# Altium project pdb_pcb.PrjPcb
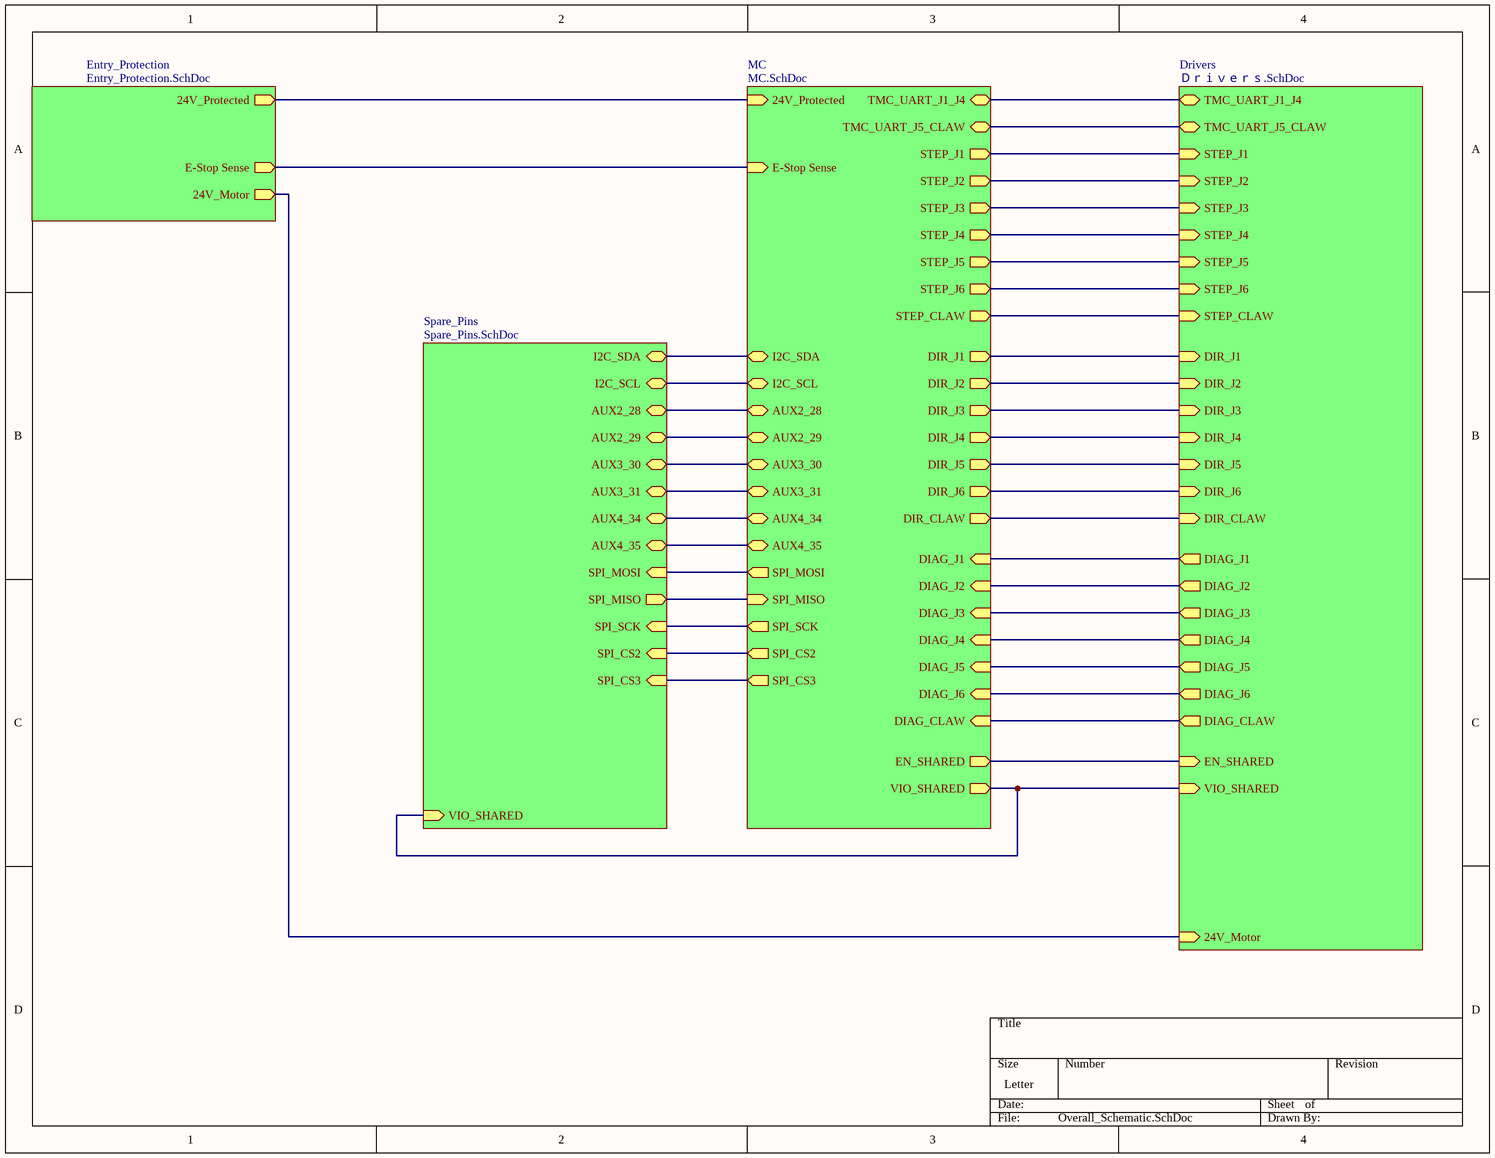
[diagram p0: Overall_Schematic.SchDoc]
5 sheets, 120 parts. Net scope: hierarchical (ports join the sheet entries above them; power ports are global).
Board file: Carrier.PcbDoc
Sheets:
  Overall_Schematic.SchDoc
    Entry_Protection = Entry_Protection.SchDoc
    MC = MC.SchDoc
    Drivers = Ｄｒｉｖｅｒｓ.SchDoc
    Spare_Pins = Spare_Pins.SchDoc

## Sheet Overall_Schematic.SchDoc
size Letter; SheetNumber: 1; SheetTotal: 5

### Sub-sheets
Drivers = Ｄｒｉｖｅｒｓ.SchDoc: TMC_UART_J1_J4 (bidir), TMC_UART_J5_CLAW (bidir), STEP_CLAW (in), STEP_J6 (in), STEP_J5 (in), STEP_J4 (in), STEP_J3 (in), STEP_J2 (in), STEP_J1 (in), DIR_J1 (in), DIR_J2 (in), DIR_J3 (in), DIR_J4 (in), DIR_J5 (in), DIR_J6 (in), DIR_CLAW (in), DIAG_CLAW (out), DIAG_J6 (out), DIAG_J5 (out), DIAG_J4 (out), DIAG_J3 (out), DIAG_J2 (out), DIAG_J1 (out), EN_SHARED (in), VIO_SHARED (in), 24V_Motor (in)
Entry_Protection = Entry_Protection.SchDoc: 24V_Protected (out), 24V_Motor (out), E-Stop Sense (out)
MC = MC.SchDoc: 24V_Protected (in), TMC_UART_J1_J4 (bidir), TMC_UART_J5_CLAW (bidir), STEP_J1 (out), STEP_J2 (out), STEP_J3 (out), STEP_J4 (out), STEP_J5 (out), STEP_J6 (out), STEP_CLAW (out), DIR_J1 (out), DIR_J2 (out), DIR_J3 (out), DIR_J4 (out), DIR_J5 (out), DIR_J6 (out), DIR_CLAW (out), DIAG_J1 (in), DIAG_J2 (in), DIAG_J3 (in), DIAG_J4 (in), DIAG_J5 (in), DIAG_J6 (in), DIAG_CLAW (in), EN_SHARED (out), VIO_SHARED (out), E-Stop Sense (in), I2C_SDA (bidir), I2C_SCL (bidir), AUX2_28 (bidir), AUX2_29 (bidir), AUX3_30 (bidir), AUX3_31 (bidir), AUX4_34 (bidir), AUX4_35 (bidir), SPI_MOSI (out), SPI_MISO (in), SPI_SCK (out), SPI_CS2 (out), SPI_CS3 (out)
Spare_Pins = Spare_Pins.SchDoc: VIO_SHARED (in), I2C_SDA (bidir), I2C_SCL (bidir), AUX2_28 (bidir), AUX2_29 (bidir), AUX3_30 (bidir), AUX3_31 (bidir), AUX4_34 (bidir), AUX4_35 (bidir), SPI_MOSI (in), SPI_MISO (out), SPI_SCK (in), SPI_CS2 (in), SPI_CS3 (in)

### Nets
24V_Motor: sheet Entry_Protection/24V_Motor, sheet Drivers/24V_Motor
24V_Protected: sheet Entry_Protection/24V_Protected, sheet MC/24V_Protected
EN_SHARED: sheet MC/EN_SHARED, sheet Drivers/EN_SHARED
VIO_SHARED: sheet MC/VIO_SHARED, sheet Drivers/VIO_SHARED, sheet Spare_Pins/VIO_SHARED
NetC31_1: sheet MC/I2C_SDA, sheet Spare_Pins/I2C_SDA
NetC32_1: sheet MC/I2C_SCL, sheet Spare_Pins/I2C_SCL
NetC33_1: sheet MC/AUX2_28, sheet Spare_Pins/AUX2_28
NetC34_1: sheet MC/AUX2_29, sheet Spare_Pins/AUX2_29
NetC35_1: sheet MC/AUX3_30, sheet Spare_Pins/AUX3_30
NetC36_1: sheet MC/AUX3_31, sheet Spare_Pins/AUX3_31
NetC37_1: sheet MC/AUX4_34, sheet Spare_Pins/AUX4_34
NetC38_1: sheet MC/AUX4_35, sheet Spare_Pins/AUX4_35
NetJ3_4: sheet Entry_Protection/E-Stop Sense, sheet MC/E-Stop Sense
NetR6_1: sheet MC/STEP_CLAW, sheet Drivers/STEP_CLAW
NetR7_2: sheet MC/STEP_J3, sheet Drivers/STEP_J3
NetR8_2: sheet MC/STEP_J2, sheet Drivers/STEP_J2
NetR12_1: sheet MC/STEP_J6, sheet Drivers/STEP_J6
NetR13_1: sheet MC/STEP_J5, sheet Drivers/STEP_J5
NetR14_2: sheet MC/TMC_UART_J5_CLAW, sheet Drivers/TMC_UART_J5_CLAW
NetR15_1: sheet MC/STEP_J1, sheet Drivers/STEP_J1
NetR16_2: sheet MC/TMC_UART_J1_J4, sheet Drivers/TMC_UART_J1_J4
NetR18_2: sheet MC/STEP_J4, sheet Drivers/STEP_J4
NetR30_1: sheet MC/SPI_MOSI, sheet Spare_Pins/SPI_MOSI
NetR31_1: sheet MC/SPI_MISO, sheet Spare_Pins/SPI_MISO
NetR32_1: sheet MC/SPI_SCK, sheet Spare_Pins/SPI_SCK
NetR33_1: sheet MC/SPI_CS2, sheet Spare_Pins/SPI_CS2
NetR34_1: sheet MC/SPI_CS3, sheet Spare_Pins/SPI_CS3
NetU2_14: sheet MC/DIR_J1, sheet Drivers/DIR_J1
NetU2_15: sheet MC/DIR_J2, sheet Drivers/DIR_J2
NetU2_16: sheet MC/DIR_J3, sheet Drivers/DIR_J3
NetU2_17: sheet MC/DIR_J4, sheet Drivers/DIR_J4
NetU2_20: sheet MC/DIR_J5, sheet Drivers/DIR_J5
NetU2_21: sheet MC/DIR_J6, sheet Drivers/DIR_J6
NetU2_22: sheet MC/DIR_CLAW, sheet Drivers/DIR_CLAW
NetU2_24: sheet MC/DIAG_J1, sheet Drivers/DIAG_J1
NetU2_25: sheet MC/DIAG_J2, sheet Drivers/DIAG_J2
NetU2_26: sheet MC/DIAG_J3, sheet Drivers/DIAG_J3
NetU2_27: sheet MC/DIAG_J4, sheet Drivers/DIAG_J4
NetU2_38: sheet MC/DIAG_J5, sheet Drivers/DIAG_J5
NetU2_39: sheet MC/DIAG_J6, sheet Drivers/DIAG_J6
NetU2_40: sheet MC/DIAG_CLAW, sheet Drivers/DIAG_CLAW

## Sheet Entry_Protection.SchDoc
size Letter; SheetNumber: 2; SheetTotal: 5
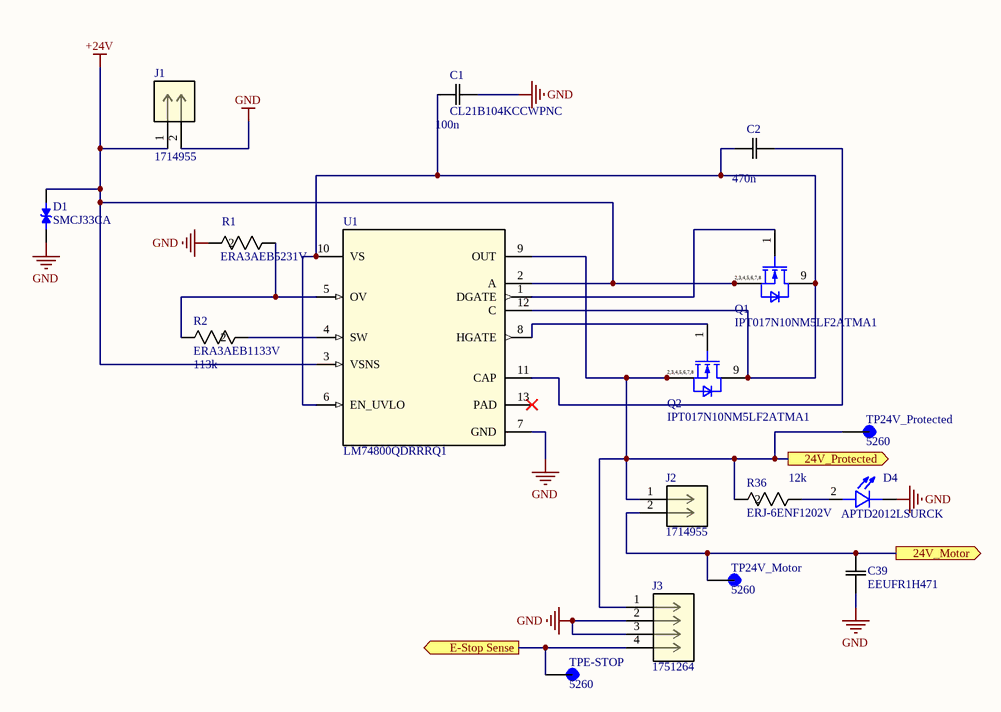
[diagram p1: Entry_Protection.SchDoc]

### Parts
C1  CL21B104KCCWPNC  Capacitor: 100n  [CAP_CL_21_SAM]
C2  Capacitance: 470n  [CAP_2012_TDK]
C39  EEUFR1H471  [CAP_12.5 X 20_PAN]
D1  SMCJ33CA  [DIOM6859X262N]
D4  APTD2012LSURCK  [LED_APTD2012LSURCK]
J1  1714955  [CONN_1714955_PXC]
J2  1714955  [CONN_1714955_PXC]
J3  1751264  [CONN_1751264_PXC]
Q1  IPT017N10NM5LF2ATMA1  [IFX-PG-HSOF-8-1-1-V]
Q2  IPT017N10NM5LF2ATMA1  [IFX-PG-HSOF-8-1-1-V]
R1  ERA3AEB5231V  [RES_ERA3A_0603_PAN]
R2  ERA3AEB1133V  Resistance: 113k  [RES_ERA3A_0603_PAN]
R36  ERJ-6ENF1202V  Resistance: 12k  [RC0805N_PAN]
TP24V_Motor  5260  [KEYSTONE_5260]
TP24V_Protected  5260  [KEYSTONE_5260]
TPE-STOP  5260  [KEYSTONE_5260]
U1  LM74800QDRRRQ1  [DRR0012E]

### Ports
24V_Motor (out, see Overall_Schematic[1A], Ｄｒｉｖｅｒｓ[1A]), 24V_Protected (out, see Overall_Schematic[1A], MC[1A]), E-Stop Sense (out, see Overall_Schematic[1A], MC[2B])

### Nets
+24V: D1.2 J1.1 Q1.2(SOURCE) Q1.3(SOURCE) Q1.4(SOURCE) Q1.5(SOURCE) Q1.6(SOURCE) Q1.7(SOURCE) Q1.8(SOURCE) U1.2(A) U1.3(VSNS)
GND: C1.2 C39.2 D1.1 D4.1(C) J1.2 J3.2 J3.3 R1.2 U1.7(GND)
24V_Motor: C39.1 J2.2 TP24V_Motor.1(TP) ; port 24V_Motor
24V_Protected: J2.1 J3.1 Q2.2(SOURCE) Q2.3(SOURCE) Q2.4(SOURCE) Q2.5(SOURCE) Q2.6(SOURCE) Q2.7(SOURCE) Q2.8(SOURCE) R36.2 TP24V_Protected.1(TP) U1.9(OUT) ; port 24V_Protected
NetC1_1: C1.1 C2.1 Q1.9(DRAIN) Q2.9(DRAIN) U1.6(EN_UVLO) U1.10(VS) U1.12(C)
NetC2_2: C2.2 U1.11(CAP)
NetD4_2: D4.2(A) R36.1
NetJ3_4: J3.4 TPE-STOP.1(TP) ; port E-Stop Sense
NetQ1_1: Q1.1(GATE) U1.1(DGATE)
NetQ2_1: Q2.1(GATE) U1.8(HGATE)
NetR1_1: R1.1 R2.1 U1.5(OV)
NetR2_2: R2.2 U1.4(SW)

Not connected (* = marked no-connect by the designer): U1 13(PAD)*

### Notes on the sheet
- (in symbol IPT017N10NM5LF2) 2,3,4,5,6,7,8

### Library data of the parts
C1 = CL21B104KCCWPNC: No Description Available; Manufacturer_Name: Samsung; Copyright: Copyright (C) 2026 Ultra Librarian. All rights reserved.; Manufacturer_Part_Number: CL21B104KCCWPNC
C2 = C2012X7R1H474K125AB: No Description Available; Manufacturer_Name: TDK; Copyright: Copyright (C) 2026 Ultra Librarian. All rights reserved.; Manufacturer_Part_Number: C2012X7R1H474K125AB
C39 = EEUFR1H471: Description; Manufacturer_Name: Panasonic; Copyright: Copyright (C) 2025 Ultra Librarian. All rights reserved.; Manufacturer_Part_Number: EEUFR1H471
D1 = CMP-004-00031-1: Availability: Unavailable; Case/Package: None; Price: None; Source: SMCJ33CA.SchLib; Value: *; Pins: 2; Component Type: Standard; Design Item ID: SMCJ33CA; MP: SMCJ33CA
D4 = CMP-005-000000-1: Red 630nm LED Indication - Discrete 1.75V 0805 (2012 Metric); MF: Kingbright; Design Item ID: APTD2012LSURCK; SnapEDA_Link: https://www.snapeda.com/parts/APTD2012LSURCK/Kingbright/view-part/?ref=snap; Component Type: Standard; Check_prices: https://www.snapeda.com/parts/APTD2012LSURCK/Kingbright/view-part/?ref=eda; Pin Count: 2; Package: 0805 Kingbright; MP: APTD2012LSURCK; Source: APTD2012LSURCK.SchLib; Value: *
J1 J2 = 1714955: PCB terminal block, nominal current: 32 A, rated voltage (III/2): 630 V, nominal cross section: 4 mmÂ², number of potentials: 2, number of rows: 1, number of positions per row: 2, product range: MKDS 5, pitch: 6.35 mm, connection method: Screw connection with tension sleeve, screw head form: L Slotted, mounting: Wave soldering, conductor/PCB connection direction: 0 Â°, color: green, Pin layout: Linear pinning, Solder pin [P]: 5.1 mm, number of solder pins per potential: 1, type of packaging: packed in cardboard. The article can be aligned to create different nos. of positions!; Manufacturer_Name: Phoenix Contact; Copyright: Copyright (C) 2025 Ultra Librarian. All rights reserved.; Manufacturer_Part_Number: 1714955; RefDes: RefDes; Type: Type
J3 = 1751264: PCB terminal block, nominal current: 17.5 A, rated voltage (III/2): 200 V, nominal cross section: 1.5 mmÂ², number of potentials: 4, number of rows: 1, number of positions per row: 4, product range: MKDS 1, pitch: 3.5 mm, connection method: Screw connection with tension sleeve, screw head form: L Slotted, mounting: Wave soldering, conductor/PCB connection direction: 0 Â°, color: green, Pin layout: Linear pinning, Solder pin [P]: 3.5 mm, number of solder pins per potential: 1, type of packaging: packed in cardboard. Suitable for CAT5; Manufacturer_Name: Phoenix Contact; Copyright: Copyright (C) 2025 Ultra Librarian. All rights reserved.; Manufacturer_Part_Number: 1751264; RefDes: RefDes; Type: Type
Q1 Q2 = IPT017N10NM5LF2: Insulated-Gate Field-Effect Transistor (IGFET), N-Channel, Enhancement, Body Diode, Pin 1 Gate, 2-8 Source, 9 Drain, 9 Pins; Manufacturer: Infineon Technologies; Manufacturer Order Number: IPT017N10NM5LF2; PackageReference: PG-HSOF-8-1
R1 = ERA3AEB5231V: Description; Manufacturer_Name: Panasonic; Copyright: Copyright (C) 2026 Ultra Librarian. All rights reserved.; Manufacturer_Part_Number: ERA3AEB5231V
R2 = ERA3AEB1133V: No Description Available; Manufacturer_Name: Panasonic; Copyright: Copyright (C) 2026 Ultra Librarian. All rights reserved.; Manufacturer_Part_Number: ERA3AEB1133V
R36 = ERJ-6ENF1202V: Description; Manufacturer_Name: Panasonic; Copyright: Copyright (C) 2026 Ultra Librarian. All rights reserved.; Manufacturer_Part_Number: ERJ-6ENF1202V
TP24V_Motor TP24V_Protected TPE-STOP = CMP-007-000000-1: TEST POINT (RED) - MINIATURE; MF: Keystone Electronics; MP: 5260; Source: 5260.SchLib; Check_prices: https://www.snapeda.com/parts/5260/Keystone/view-part/?ref=eda; SnapEDA_Link: https://www.snapeda.com/parts/5260/Keystone/view-part/?ref=snap; Package: None; Pin Count: 1; Value: *; Design Item ID: 5260; Component Type: Standard
U1 = LM74800QDRRRQ1: 3-V to 65-V, automotive ideal diode controller driving back to back NFETs 12-WSON -40 to 125; Manufacturer_Name: Texas Instruments; TYPE: TYPE; RefDes: RefDes; Copyright: Copyright (C) 2026 Ultra Librarian. All rights reserved.; Manufacturer_Part_Number: LM74800QDRRRQ1

## Sheet MC.SchDoc
size Letter; SheetNumber: 3; SheetTotal: 5
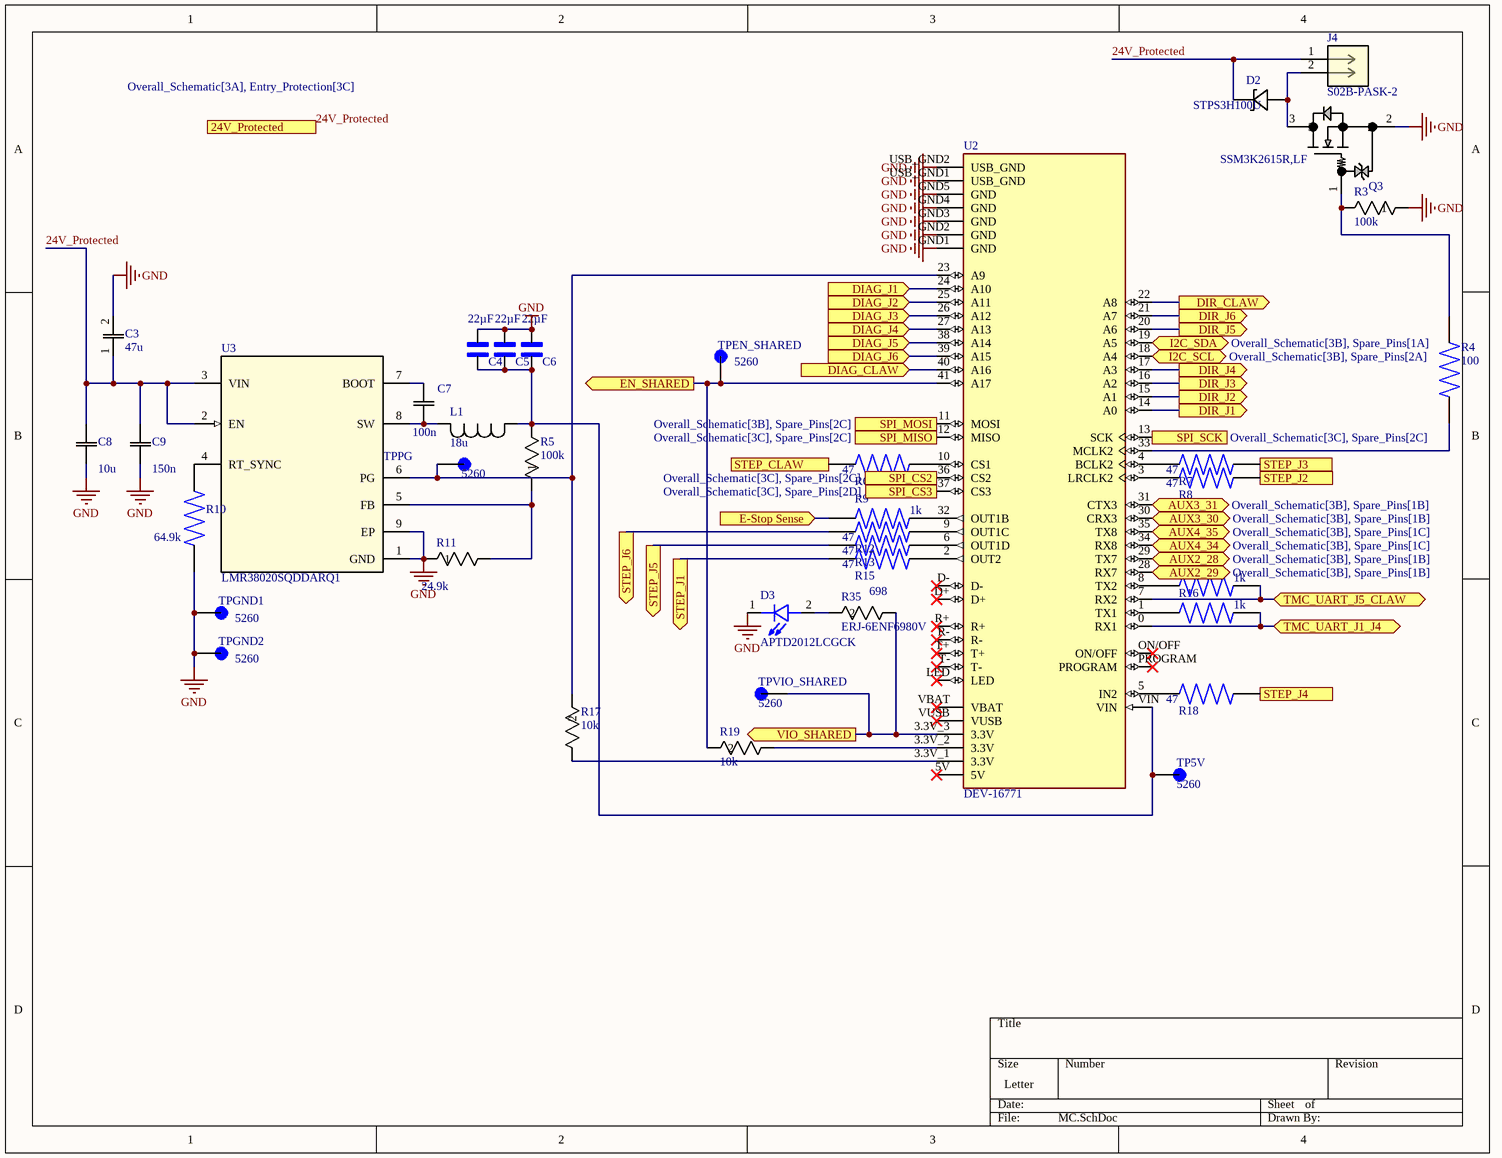
[diagram p2: MC.SchDoc]

### Parts
C3  Capacitance: 47u  [CAP_EEUFC_63X112_PAN]  (hidden comment: EEUFR1J470)
C4  Capacitance: 22µF  [CAPC3225X270N]  (hidden comment: CL32B226KAJNNNE)
C5  Capacitance: 22µF  [CAPC3225X270N]  (hidden comment: CL32B226KAJNNNE)
C6  Capacitance: 22µF  [CAPC3225X270N]  (hidden comment: CL32B226KAJNNNE)
C7  Capacitance: 100n  [CAP_CL_21_SAM]  (hidden comment: CL21B104KCCWPNC)
C8  Capacitance: 10u  [CAP_22201C106MAT2A_KYO]  (hidden comment: 22201C106MAT2A)
C9  Capacitance: 150n  [CAPC220145_140N_KEM]  (hidden comment: C0805C154K1RECTU)
D2  STPS3H100U  [SMB_STM]
D3  APTD2012LCGCK  [LED_APTD2012LCGCK]
J4  S02B-PASK-2  [CONN2_S02B-PASK-2_JST]
L1  Inductance: 18u  [IND_XGL6060_COC]  (hidden comment: XGL6060-183MEC)
Q3  SSM3K2615R,LF  [SOT-23F_TOS]
R3  Resistance: 100k  [RES_ERA3V,3K_PAN]  (hidden comment: ERA-3VEB1003V)
R4  value 100  [RES_ERA3VEB1000V]  (hidden comment: ERA3VEB1000V)
R5  Resistance: 100k  [RES_ERA3V,3K_PAN]  (hidden comment: ERA-3VEB1003V)
R6  Resistance: 47  [RES_ERA3VEB47R0V]  (hidden comment: ERA3VEB47R0V)
R7  Resistance: 47  [RES_ERA3VEB47R0V]  (hidden comment: ERA3VEB47R0V)
R8  Resistance: 47  [RES_ERA3VEB47R0V]  (hidden comment: ERA3VEB47R0V)
R9  value 1k  [RES_ERA3VEB1001V]  (hidden comment: ERA3VEB1001V)
R10  Resistance: 64.9k  [RES_ERJ3EKF6492V]  (hidden comment: ERJ3EKF6492V)
R11  Resistance: 24.9k  [RES_ERA3V,3K_PAN]  (hidden comment: ERA-3VEB2492V)
R12  Resistance: 47  [RES_ERA3VEB47R0V]  (hidden comment: ERA3VEB47R0V)
R13  Resistance: 47  [RES_ERA3VEB47R0V]  (hidden comment: ERA3VEB47R0V)
R14  value 1k  [RES_ERA3VEB1001V]  (hidden comment: ERA3VEB1001V)
R15  Resistance: 47  [RES_ERA3VEB47R0V]  (hidden comment: ERA3VEB47R0V)
R16  value 1k  [RES_ERA3VEB1001V]  (hidden comment: ERA3VEB1001V)
R17  Resistance: 10k  [RC0603N_PAN]  (hidden comment: ERJ-3EKF1002V)
R18  Resistance: 47  [RES_ERA3VEB47R0V]  (hidden comment: ERA3VEB47R0V)
R19  Resistance: 10k  [RC0603N_PAN]  (hidden comment: ERJ-3EKF1002V)
R35  ERJ-6ENF6980V  Resistance: 698  [RC0805N_PAN]
TP5V  5260  [KEYSTONE_5260]
TPEN_SHARED  5260  [KEYSTONE_5260]
TPGND1  5260  [KEYSTONE_5260]
TPGND2  5260  [KEYSTONE_5260]
TPPG  5260  [KEYSTONE_5260]
TPVIO_SHARED  5260  [KEYSTONE_5260]
U2  DEV-16771  [MODULE_DEV-16771]
U3  LMR38020SQDDARQ1  [DDA0008E-IPC_A]

### Ports
24V_Protected (in, see Overall_Schematic[3A], Entry_Protection[3C]), AUX2_28 (bidir, see Overall_Schematic[3B], Spare_Pins[1B]), AUX2_29 (bidir, see Overall_Schematic[3B], Spare_Pins[1B]), AUX3_30 (bidir, see Overall_Schematic[3B], Spare_Pins[1B]), AUX3_31 (bidir, see Overall_Schematic[3B], Spare_Pins[1B]), AUX4_34 (bidir, see Overall_Schematic[3B], Spare_Pins[1C]), AUX4_35 (bidir, see Overall_Schematic[3B], Spare_Pins[1C]), DIAG_CLAW (in, see Overall_Schematic[3C], Ｄｒｉｖｅｒｓ[4C]), DIAG_J1 (in, see Overall_Schematic[3B], Ｄｒｉｖｅｒｓ[1B]), DIAG_J2 (in, see Overall_Schematic[3C], Ｄｒｉｖｅｒｓ[2B]), DIAG_J3 (in, see Overall_Schematic[3C], Ｄｒｉｖｅｒｓ[3B]), DIAG_J4 (in, see Overall_Schematic[3C], Ｄｒｉｖｅｒｓ[4B]), DIAG_J5 (in, see Overall_Schematic[3C], Ｄｒｉｖｅｒｓ[1D]), DIAG_J6 (in, see Overall_Schematic[3C], Ｄｒｉｖｅｒｓ[2D]), DIR_CLAW (out, see Overall_Schematic[3B], Ｄｒｉｖｅｒｓ[3C]), DIR_J1 (out, see Overall_Schematic[3B], Ｄｒｉｖｅｒｓ[1B]), DIR_J2 (out, see Overall_Schematic[3B], Ｄｒｉｖｅｒｓ[2B]), DIR_J3 (out, see Overall_Schematic[3B], Ｄｒｉｖｅｒｓ[3B]), DIR_J4 (out, see Overall_Schematic[3B], Ｄｒｉｖｅｒｓ[4B]), DIR_J5 (out, see Overall_Schematic[3B], Ｄｒｉｖｅｒｓ[1D]), DIR_J6 (out, see Overall_Schematic[3B], Ｄｒｉｖｅｒｓ[2D]), E-Stop Sense (in, see Overall_Schematic[3A], Entry_Protection[2D]), EN_SHARED (out, see Overall_Schematic[3C], Ｄｒｉｖｅｒｓ[1A]), I2C_SCL (bidir, see Overall_Schematic[3B], Spare_Pins[2A]), I2C_SDA (bidir, see Overall_Schematic[3B], Spare_Pins[1A]), SPI_CS2 (out, see Overall_Schematic[3C], Spare_Pins[2C]), SPI_CS3 (out, see Overall_Schematic[3C], Spare_Pins[2D]), SPI_MISO (in, see Overall_Schematic[3C], Spare_Pins[2C]), SPI_MOSI (out, see Overall_Schematic[3B], Spare_Pins[2C]), SPI_SCK (out, see Overall_Schematic[3C], Spare_Pins[2C]), STEP_CLAW (out, see Overall_Schematic[3B], Ｄｒｉｖｅｒｓ[3C]), STEP_J1 (out, see Overall_Schematic[3A], Ｄｒｉｖｅｒｓ[1B]), STEP_J2 (out, see Overall_Schematic[3A], Ｄｒｉｖｅｒｓ[2B]), STEP_J3 (out, see Overall_Schematic[3A], Ｄｒｉｖｅｒｓ[2B]), STEP_J4 (out, see Overall_Schematic[3A], Ｄｒｉｖｅｒｓ[4B]), STEP_J5 (out, see Overall_Schematic[3A], Ｄｒｉｖｅｒｓ[1D]), STEP_J6 (out, see Overall_Schematic[3A], Ｄｒｉｖｅｒｓ[2D]), TMC_UART_J1_J4 (bidir, see Overall_Schematic[3A], Ｄｒｉｖｅｒｓ[1C]), TMC_UART_J5_CLAW (bidir, see Overall_Schematic[3A], Ｄｒｉｖｅｒｓ[1D]), VIO_SHARED (out, see Overall_Schematic[3C], Spare_Pins[1A], Ｄｒｉｖｅｒｓ[1A])

### Nets
GND: C3.2 C4.2 C5.2 C6.2 C8.1 C9.1 D3.1(C) Q3.2 R3.1 R10.1 R11.1 TPGND1.1(TP) TPGND2.1(TP) U2.GND1(GND) U2.GND2(GND) U2.GND3(GND) U2.GND4(GND) U2.GND5(GND) U2.USB_GND1(USB_GND) U2.USB_GND2(USB_GND) U3.1(GND) U3.9(EP)
24V_Protected: C3.1 C8.2 C9.2 D2.2(A) J4.1 U3.2(EN) U3.3(VIN) ; port 24V_Protected
EN_SHARED: R19.2 TPEN_SHARED.1(TP) U2.41(A17) ; port EN_SHARED
VIO_SHARED: R35.1 TPVIO_SHARED.1(TP) U2.3.3V_3(3.3V) ; port VIO_SHARED
NetC4_1: C4.1 C5.1 C6.1 L1.2 R5.2 TP5V.1(TP) U2.VIN
NetC7_1: C7.1 U3.7(BOOT)
NetC7_2: C7.2 L1.1 U3.8(SW)
NetC31_1: U2.19(A5) ; port I2C_SDA
NetC32_1: U2.18(A4) ; port I2C_SCL
NetC33_1: U2.29(TX7) ; port AUX2_28
NetC34_1: U2.28(RX7) ; port AUX2_29
NetC35_1: U2.30(CRX3) ; port AUX3_30
NetC36_1: U2.31(CTX3) ; port AUX3_31
NetC37_1: U2.34(RX8) ; port AUX4_34
NetC38_1: U2.35(TX8) ; port AUX4_35
NetD2_1: D2.1(K) J4.2 Q3.3
NetD3_2: D3.2(A) R35.2
NetJ3_4: R9.1 ; port E-Stop Sense
NetQ3_1: Q3.1 R3.2 R4.2
NetR4_1: R4.1 U2.33(MCLK2)
NetR5_1: R5.1 R11.2 U3.5(FB)
NetR6_1: R6.1 ; port STEP_CLAW
NetR6_2: R6.2 U2.10(CS1)
NetR7_1: R7.1 U2.4(BCLK2)
NetR7_2: R7.2 ; port STEP_J3
NetR8_1: R8.1 U2.3(LRCLK2)
NetR8_2: R8.2 ; port STEP_J2
NetR9_2: R9.2 U2.32(OUT1B)
NetR10_2: R10.2 U3.4(RT_SYNC)
NetR12_1: R12.1 ; port STEP_J6
NetR12_2: R12.2 U2.9(OUT1C)
NetR13_1: R13.1 ; port STEP_J5
NetR13_2: R13.2 U2.6(OUT1D)
NetR14_1: R14.1 U2.8(TX2)
NetR14_2: R14.2 U2.7(RX2) ; port TMC_UART_J5_CLAW
NetR15_1: R15.1 ; port STEP_J1
NetR15_2: R15.2 U2.2(OUT2)
NetR16_1: R16.1 U2.1(TX1)
NetR16_2: R16.2 U2.0(RX1) ; port TMC_UART_J1_J4
NetR17_1: R17.1 U2.3.3V_1(3.3V)
NetR17_2: R17.2 TPPG.1(TP) U2.23(A9) U3.6(PG)
NetR18_1: R18.1 U2.5(IN2)
NetR18_2: R18.2 ; port STEP_J4
NetR19_1: R19.1 U2.3.3V_2(3.3V)
NetR30_1: U2.11(MOSI) ; port SPI_MOSI
NetR31_1: U2.12(MISO) ; port SPI_MISO
NetR32_1: U2.13(SCK) ; port SPI_SCK
NetR33_1: U2.36(CS2) ; port SPI_CS2
NetR34_1: U2.37(CS3) ; port SPI_CS3
NetU2_14: U2.14(A0) ; port DIR_J1
NetU2_15: U2.15(A1) ; port DIR_J2
NetU2_16: U2.16(A2) ; port DIR_J3
NetU2_17: U2.17(A3) ; port DIR_J4
NetU2_20: U2.20(A6) ; port DIR_J5
NetU2_21: U2.21(A7) ; port DIR_J6
NetU2_22: U2.22(A8) ; port DIR_CLAW
NetU2_24: U2.24(A10) ; port DIAG_J1
NetU2_25: U2.25(A11) ; port DIAG_J2
NetU2_26: U2.26(A12) ; port DIAG_J3
NetU2_27: U2.27(A13) ; port DIAG_J4
NetU2_38: U2.38(A14) ; port DIAG_J5
NetU2_39: U2.39(A15) ; port DIAG_J6
NetU2_40: U2.40(A16) ; port DIAG_CLAW

Not connected (* = marked no-connect by the designer): U2 5V* D+* D-* LED* ON/OFF* PROGRAM* R+* R-* T+* T-* VBAT* VUSB*

### Library data of the parts
C3 = EEUFR1J470: Description; Manufacturer_Name: Panasonic; Copyright: Copyright (C) 2026 Ultra Librarian. All rights reserved.; Manufacturer_Part_Number: EEUFR1J470
C4-C6 = CMP-001-00083-1: 22 ÂµF Â±10% 25V Ceramic Capacitor X7R 1210 (3225 Metric); MF: Samsung Electro-Mechanics; Source: CL32B226KAJNNNE.SchLib; Component Type: Standard; Pins: 2; Case/Package: SMD-2 Samsung; Check_prices: https://www.snapeda.com/parts/CL32B226KAJNNNE/Samsung/view-part/?ref=eda; MP: CL32B226KAJNNNE; Design Item ID: CL32B226KAJNNNE; SnapEDA_Link: https://www.snapeda.com/parts/CL32B226KAJNNNE/Samsung/view-part/?ref=snap
C7 = CL21B104KCCWPNC: as C1 on sheet Entry_Protection; Copyright: Copyright (C) 2026 Ultra Librarian. All rights reserved.; Manufacturer_Part_Number: CL21B104KCCWPNC
C8 = 22201C106MAT2A: Description; Manufacturer_Name: KYOCERA AVX; Copyright: Copyright (C) 2026 Ultra Librarian. All rights reserved.; Manufacturer_Part_Number: 22201C106MAT2A
C9 = C0805C154K1RECTU: ESD SMD Comm X7R, Ceramic, 0.15 uF, 10%, 100 VDC, X7R, SMD, MLCC, Temperature Stable, Electro Static Discharge, Class II, 0805; Manufacturer_Name: Kemet; Copyright: Copyright (C) 2026 Ultra Librarian. All rights reserved.; Manufacturer_Part_Number: C0805C154K1RECTU
D2 = STPS3H100U: 100 V, 3 A Schottky rectifier; Manufacturer_Name: STMicroelectronics; Copyright: Copyright (C) 2025 Ultra Librarian. All rights reserved.; Manufacturer_Part_Number: STPS3H100U
D3 = CMP-003-000000-1: Green 570nm LED Indication - Discrete 1.9V 0805 (2012 Metric); MF: Kingbright; Value: *; MP: APTD2012LCGCK; Check_prices: https://www.snapeda.com/parts/APTD2012LCGCK/Kingbright/view-part/?ref=eda; Source: APTD2012LCGCK.SchLib; SnapEDA_Link: https://www.snapeda.com/parts/APTD2012LCGCK/Kingbright/view-part/?ref=snap; Component Type: Standard; Pin Count: 2; Design Item ID: APTD2012LCGCK; Package: 0805 Kingbright
J4 = S02B-PASK-2: Description; Manufacturer_Name: JST; Copyright: Copyright (C) 2026 Ultra Librarian. All rights reserved.; Manufacturer_Part_Number: S02B-PASK-2; RefDes: RefDes; Type: Type
L1 = XGL6060-183MEC: Description; Manufacturer_Name: Coilcraft; Copyright: Copyright (C) 2026 Ultra Librarian. All rights reserved.; Manufacturer_Part_Number: XGL6060-183MEC
Q3 = SSM3K2615R,LF: N-ch MOSFET, 60 V, 2.0 A, 0.3 Î©@10V, SOT-23F; Manufacturer_Name: Toshiba Electronic Devices & Storage Corp.; Copyright: Copyright (C) 2026 Ultra Librarian. All rights reserved.; Manufacturer_Part_Number: SSM3K2615R,LF; Datasheet: https://toshiba.semicon-storage.com/info/docget.jsp?did=15659&prodName=SSM3K2615R; RefDes: Refdes; Type: Type
R3 R5 = ERA-3VEB1003V: No Description Available; Manufacturer_Name: Panasonic; Copyright: Copyright (C) 2026 Ultra Librarian. All rights reserved.; Manufacturer_Part_Number: ERA-3VEB1003V
R4 = CMP-009-00180-1: Design Item ID: ERA3VEB1000V; MP: ERA3VEB1000V; Component Type: Standard; Pins: 2; Availability: Unavailable; Source: ERA3VEB1000V.SchLib; Case/Package: None; Price: None
R6-R8 R12 R13 R15 R18 = CMP-009-00179-1: MP: ERA3VEB47R0V; Component Type: Standard; Pins: 2; Source: ERA3VEB47R0V.SchLib; Price: None; Availability: Unavailable; Design Item ID: ERA3VEB47R0V; Case/Package: None
R9 R14 R16 = CMP-009-00178-1: Case/Package: None; Source: ERA3VEB1001V.SchLib; Price: None; Pins: 2; Availability: Unavailable; MP: ERA3VEB1001V; Design Item ID: ERA3VEB1001V; Component Type: Standard
R10 = CMP-009-00177-1: MF: {'manufacturer': u'Panasonic Electronic Components'}; Case/Package: None; Availability: Unavailable; Price: None; Component Type: Standard; MP: ERJ3EKF6492V; Source: ERJ3EKF6492V.SchLib; Design Item ID: ERJ3EKF6492V; Pins: 2
R11 = ERA-3VEB2492V: No Description Available; Manufacturer_Name: Panasonic; Copyright: Copyright (C) 2026 Ultra Librarian. All rights reserved.; Manufacturer_Part_Number: ERA-3VEB2492V
R17 R19 = ERJ-3EKF1002V: SMD-Resistor, 0603, 0,063W, 1%, 100ppm; Manufacturer_Name: Panasonic; Copyright: Copyright (C) 2025 Ultra Librarian. All rights reserved.; Manufacturer_Part_Number: ERJ-3EKF1002V
R35 = ERJ-6ENF6980V: No Description Available; Manufacturer_Name: Panasonic; Copyright: Copyright (C) 2026 Ultra Librarian. All rights reserved.; Manufacturer_Part_Number: ERJ-6ENF6980V
TP5V TPEN_SHARED TPGND1 TPGND2 TPPG TPVIO_SHARED = CMP-007-000000-1: as TP24V_Motor on sheet Entry_Protection; MP: 5260; Source: 5260.SchLib; Check_prices: https://www.snapeda.com/parts/5260/Keystone/view-part/?ref=eda; SnapEDA_Link: https://www.snapeda.com/parts/5260/Keystone/view-part/?ref=snap; Package: None; Pin Count: 1; Value: *; Design Item ID: 5260; Component Type: Standard
U2 = CMP-003-000000-1: RT1062 Teensy 4.1 series ARM® Cortex®-M7 MPU Embedded Evaluation Board; MF: SparkFun Electronics; Source: DEV-16771.SchLib; Design Item ID: DEV-16771; Pin Count: 65; Value: *; Check_prices: https://www.snapeda.com/parts/DEV-16771/SparkFun+Electronics/view-part/?ref=eda; Component Type: Standard; SnapEDA_Link: https://www.snapeda.com/parts/DEV-16771/SparkFun+Electronics/view-part/?ref=snap; Package: None; MP: DEV-16771
U3 = LMR38020SQDDARQ1: Automotive SIMPLE SWITCHERÂ® power converter 4.2-V to 80-V, 2-A, synchronous buck converter 8-SO PowerPAD -40 to 150; Manufacturer_Name: Texas Instruments; Copyright: Copyright (C) 2025 Ultra Librarian. All rights reserved.; Manufacturer_Part_Number: LMR38020SQDDARQ1; RefDes: >Name; TYPE: >Value

## Sheet Ｄｒｉｖｅｒｓ.SchDoc
size Letter; SheetNumber: 4; SheetTotal: 5
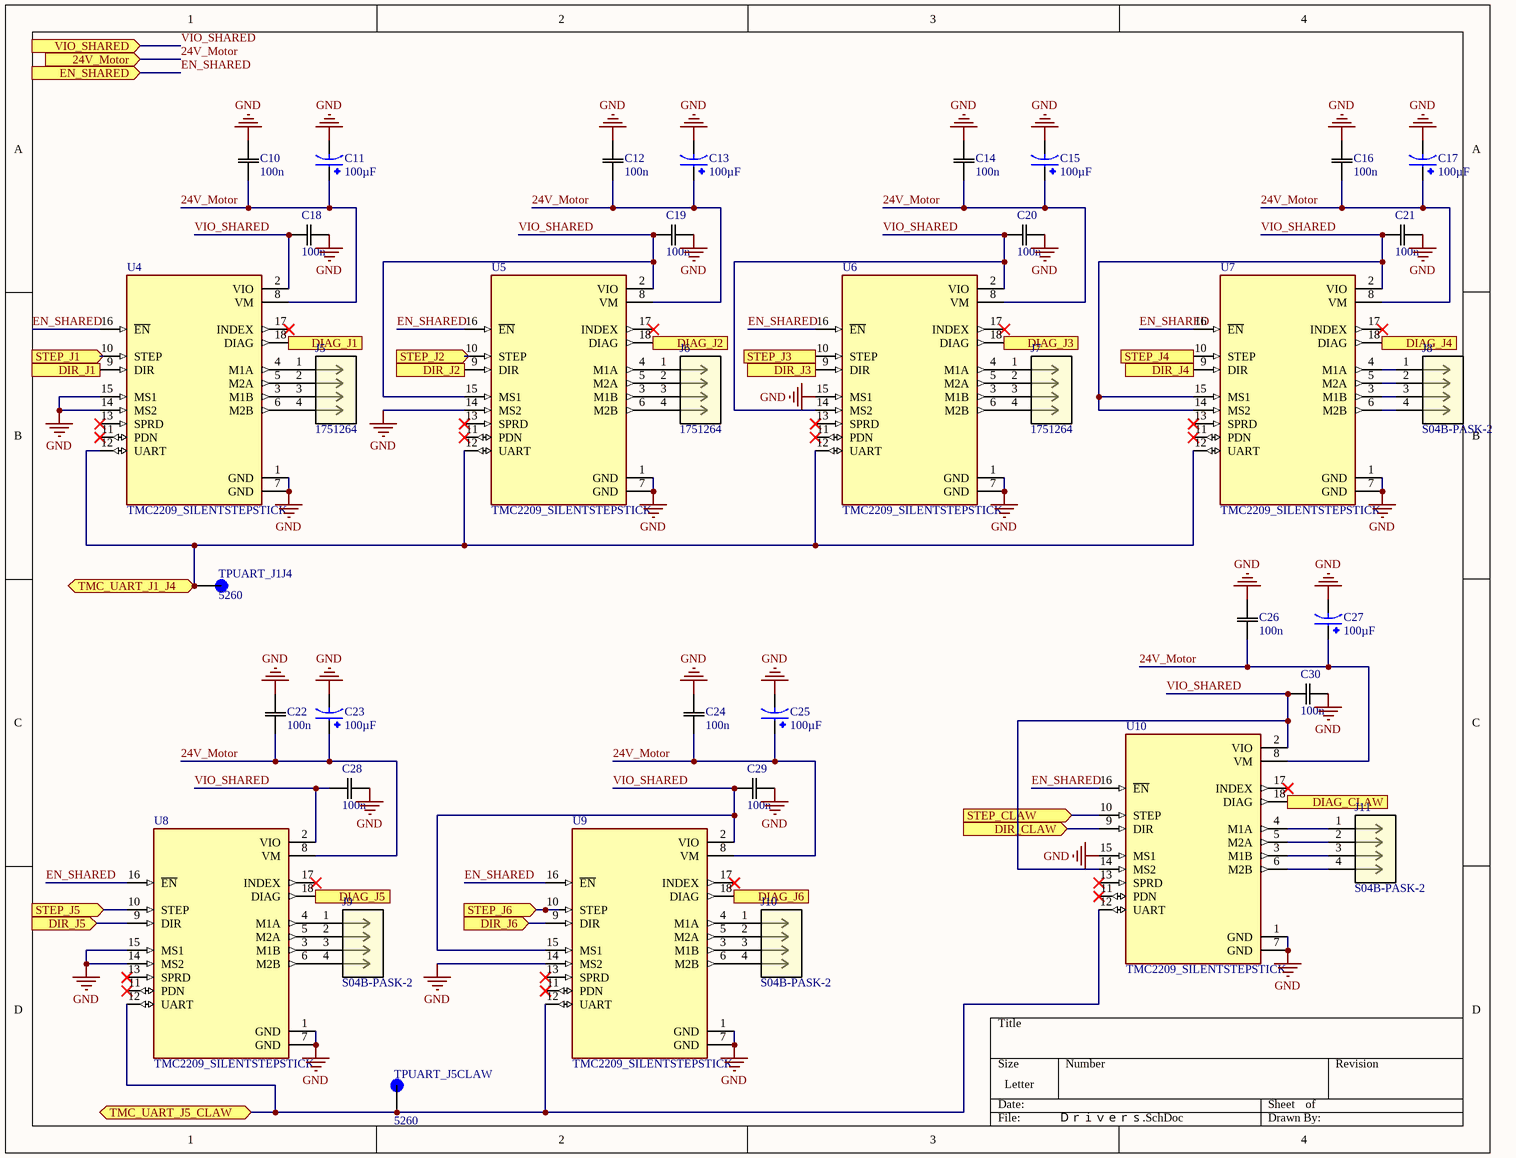
[diagram p3: Ｄｒｉｖｅｒｓ.SchDoc]

### Parts
C10  Capacitance: 100n  [CAP_CL_21_SAM]  (hidden comment: CL21B104KCCWPNC)
C11  value 100µF  [CAPPRD500W60D800H1150]  (hidden comment: EEUFR1H101B)
C12  Capacitance: 100n  [CAP_CL_21_SAM]  (hidden comment: CL21B104KCCWPNC)
C13  value 100µF  [CAPPRD500W60D800H1150]  (hidden comment: EEUFR1H101B)
C14  Capacitance: 100n  [CAP_CL_21_SAM]  (hidden comment: CL21B104KCCWPNC)
C15  value 100µF  [CAPPRD500W60D800H1150]  (hidden comment: EEUFR1H101B)
C16  Capacitance: 100n  [CAP_CL_21_SAM]  (hidden comment: CL21B104KCCWPNC)
C17  value 100µF  [CAPPRD500W60D800H1150]  (hidden comment: EEUFR1H101B)
C18  Capacitance: 100n  [CAP_CL_21_SAM]  (hidden comment: CL21B104KCCWPNC)
C19  Capacitance: 100n  [CAP_CL_21_SAM]  (hidden comment: CL21B104KCCWPNC)
C20  Capacitance: 100n  [CAP_CL_21_SAM]  (hidden comment: CL21B104KCCWPNC)
C21  Capacitance: 100n  [CAP_CL_21_SAM]  (hidden comment: CL21B104KCCWPNC)
C22  Capacitance: 100n  [CAP_CL_21_SAM]  (hidden comment: CL21B104KCCWPNC)
C23  value 100µF  [CAPPRD500W60D800H1150]  (hidden comment: EEUFR1H101B)
C24  Capacitance: 100n  [CAP_CL_21_SAM]  (hidden comment: CL21B104KCCWPNC)
C25  value 100µF  [CAPPRD500W60D800H1150]  (hidden comment: EEUFR1H101B)
C26  Capacitance: 100n  [CAP_CL_21_SAM]  (hidden comment: CL21B104KCCWPNC)
C27  value 100µF  [CAPPRD500W60D800H1150]  (hidden comment: EEUFR1H101B)
C28  Capacitance: 100n  [CAP_CL_21_SAM]  (hidden comment: CL21B104KCCWPNC)
C29  Capacitance: 100n  [CAP_CL_21_SAM]  (hidden comment: CL21B104KCCWPNC)
C30  Capacitance: 100n  [CAP_CL_21_SAM]  (hidden comment: CL21B104KCCWPNC)
J5  1751264  [CONN_1751264_PXC]
J6  1751264  [CONN_1751264_PXC]
J7  1751264  [CONN_1751264_PXC]
J8  S04B-PASK-2  [CONN4_S04B-PASK_JST]
J9  S04B-PASK-2  [CONN4_S04B-PASK_JST]
J10  S04B-PASK-2  [CONN4_S04B-PASK_JST]
J11  S04B-PASK-2  [CONN4_S04B-PASK_JST]
TPUART_J1J4  5260  [KEYSTONE_5260]
TPUART_J5CLAW  5260  [KEYSTONE_5260]
U4  TMC2209_SILENTSTEPSTICK  [MODULE_TMC2209_SILENTSTEPSTICK]
U5  TMC2209_SILENTSTEPSTICK  [MODULE_TMC2209_SILENTSTEPSTICK]
U6  TMC2209_SILENTSTEPSTICK  [MODULE_TMC2209_SILENTSTEPSTICK]
U7  TMC2209_SILENTSTEPSTICK  [MODULE_TMC2209_SILENTSTEPSTICK]
U8  TMC2209_SILENTSTEPSTICK  [MODULE_TMC2209_SILENTSTEPSTICK]
U9  TMC2209_SILENTSTEPSTICK  [MODULE_TMC2209_SILENTSTEPSTICK]
U10  TMC2209_SILENTSTEPSTICK  [MODULE_TMC2209_SILENTSTEPSTICK]

### Ports
24V_Motor (in, see Overall_Schematic[4D], Entry_Protection[4C]), DIAG_CLAW (out, see Overall_Schematic[4C], MC[3B]), DIAG_J1 (out, see Overall_Schematic[4B], MC[3A]), DIAG_J2 (out, see Overall_Schematic[4C], MC[3B]), DIAG_J3 (out, see Overall_Schematic[4C], MC[3B]), DIAG_J4 (out, see Overall_Schematic[4C], MC[3B]), DIAG_J5 (out, see Overall_Schematic[4C], MC[3B]), DIAG_J6 (out, see Overall_Schematic[4C], MC[3B]), DIR_CLAW (in, see Overall_Schematic[4B], MC[4B]), DIR_J1 (in, see Overall_Schematic[4B], MC[4B]), DIR_J2 (in, see Overall_Schematic[4B], MC[4B]), DIR_J3 (in, see Overall_Schematic[4B], MC[4B]), DIR_J4 (in, see Overall_Schematic[4B], MC[4B]), DIR_J5 (in, see Overall_Schematic[4B], MC[4B]), DIR_J6 (in, see Overall_Schematic[4B], MC[4B]), EN_SHARED (in, see Overall_Schematic[4C], MC[2B]), STEP_CLAW (in, see Overall_Schematic[4B], MC[2B]), STEP_J1 (in, see Overall_Schematic[4A], MC[2C]), STEP_J2 (in, see Overall_Schematic[4A], MC[4B]), STEP_J3 (in, see Overall_Schematic[4A], MC[4B]), STEP_J4 (in, see Overall_Schematic[4A], MC[4C]), STEP_J5 (in, see Overall_Schematic[4A], MC[2C]), STEP_J6 (in, see Overall_Schematic[4A], MC[2C]), TMC_UART_J1_J4 (bidir, see Overall_Schematic[4A], MC[4C]), TMC_UART_J5_CLAW (bidir, see Overall_Schematic[4A], MC[4C]), VIO_SHARED (in, see Overall_Schematic[4C], MC[3C], Spare_Pins[1A])

### Nets
GND: C10.2 C11.N C12.2 C13.N C14.2 C15.N C16.2 C17.N C18.2 C19.2 C20.2 C21.2 C22.2 C23.N C24.2 C25.N C26.2 C27.N C28.2 C29.2 C30.2 U4.1(GND) U4.7(GND) U4.14(MS2) U4.15(MS1) U5.1(GND) U5.7(GND) U5.14(MS2) U6.1(GND) U6.7(GND) U6.15(MS1) U7.1(GND) U7.7(GND) U8.1(GND) U8.7(GND) U8.14(MS2) U8.15(MS1) U9.1(GND) U9.7(GND) U9.14(MS2) U10.1(GND) U10.7(GND) U10.15(MS1)
24V_Motor: C10.1 C11.P C12.1 C13.P C14.1 C15.P C16.1 C17.P C22.1 C23.P C24.1 C25.P C26.1 C27.P U4.8(VM) U5.8(VM) U6.8(VM) U7.8(VM) U8.8(VM) U9.8(VM) U10.8(VM) ; port 24V_Motor
EN_SHARED: U4.16(~{EN}) U5.16(~{EN}) U6.16(~{EN}) U7.16(~{EN}) U8.16(~{EN}) U9.16(~{EN}) U10.16(~{EN}) ; port EN_SHARED
VIO_SHARED: C18.1 C19.1 C20.1 C21.1 C28.1 C29.1 C30.1 U4.2(VIO) U5.2(VIO) U5.15(MS1) U6.2(VIO) U6.14(MS2) U7.2(VIO) U7.14(MS2) U7.15(MS1) U8.2(VIO) U9.2(VIO) U9.15(MS1) U10.2(VIO) U10.14(MS2) ; port VIO_SHARED
NetJ5_1: J5.1 U4.4(M1A)
NetJ5_2: J5.2 U4.5(M2A)
NetJ5_3: J5.3 U4.3(M1B)
NetJ5_4: J5.4 U4.6(M2B)
NetJ6_1: J6.1 U5.4(M1A)
NetJ6_2: J6.2 U5.5(M2A)
NetJ6_3: J6.3 U5.3(M1B)
NetJ6_4: J6.4 U5.6(M2B)
NetJ7_1: J7.1 U6.4(M1A)
NetJ7_2: J7.2 U6.5(M2A)
NetJ7_3: J7.3 U6.3(M1B)
NetJ7_4: J7.4 U6.6(M2B)
NetJ8_1: J8.1 U7.4(M1A)
NetJ8_2: J8.2 U7.5(M2A)
NetJ8_3: J8.3 U7.3(M1B)
NetJ8_4: J8.4 U7.6(M2B)
NetJ9_1: J9.1 U8.4(M1A)
NetJ9_2: J9.2 U8.5(M2A)
NetJ9_3: J9.3 U8.3(M1B)
NetJ9_4: J9.4 U8.6(M2B)
NetJ10_1: J10.1 U9.4(M1A)
NetJ10_2: J10.2 U9.5(M2A)
NetJ10_3: J10.3 U9.3(M1B)
NetJ10_4: J10.4 U9.6(M2B)
NetJ11_1: J11.1 U10.4(M1A)
NetJ11_2: J11.2 U10.5(M2A)
NetJ11_3: J11.3 U10.3(M1B)
NetJ11_4: J11.4 U10.6(M2B)
NetR6_1: U10.10(STEP) ; port STEP_CLAW
NetR7_2: U6.10(STEP) ; port STEP_J3
NetR8_2: U5.10(STEP) ; port STEP_J2
NetR12_1: U9.10(STEP) ; port STEP_J6
NetR13_1: U8.10(STEP) ; port STEP_J5
NetR14_2: TPUART_J5CLAW.1(TP) U8.12(UART) U9.12(UART) U10.12(UART) ; port TMC_UART_J5_CLAW
NetR15_1: U4.10(STEP) ; port STEP_J1
NetR16_2: TPUART_J1J4.1(TP) U4.12(UART) U5.12(UART) U6.12(UART) U7.12(UART) ; port TMC_UART_J1_J4
NetR18_2: U7.10(STEP) ; port STEP_J4
NetU2_14: U4.9(DIR) ; port DIR_J1
NetU2_15: U5.9(DIR) ; port DIR_J2
NetU2_16: U6.9(DIR) ; port DIR_J3
NetU2_17: U7.9(DIR) ; port DIR_J4
NetU2_20: U8.9(DIR) ; port DIR_J5
NetU2_21: U9.9(DIR) ; port DIR_J6
NetU2_22: U10.9(DIR) ; port DIR_CLAW
NetU2_24: U4.18(DIAG) ; port DIAG_J1
NetU2_25: U5.18(DIAG) ; port DIAG_J2
NetU2_26: U6.18(DIAG) ; port DIAG_J3
NetU2_27: U7.18(DIAG) ; port DIAG_J4
NetU2_38: U8.18(DIAG) ; port DIAG_J5
NetU2_39: U9.18(DIAG) ; port DIAG_J6
NetU2_40: U10.18(DIAG) ; port DIAG_CLAW

Not connected (* = marked no-connect by the designer): U4 11(PDN)* 13(SPRD)* 17(INDEX)*; U5 11(PDN)* 13(SPRD)* 17(INDEX)*; U6 11(PDN)* 13(SPRD)* 17(INDEX)*; U7 11(PDN)* 13(SPRD)* 17(INDEX)*; U8 11(PDN)* 13(SPRD)* 17(INDEX)*; U9 11(PDN)* 13(SPRD)* 17(INDEX)*; U10 11(PDN)* 13(SPRD)* 17(INDEX)*

### Library data of the parts
C10 C12 C14 C16 C18-C22 C24 C26 C28-C30 = CL21B104KCCWPNC: as C1 on sheet Entry_Protection; Copyright: Copyright (C) 2026 Ultra Librarian. All rights reserved.; Manufacturer_Part_Number: CL21B104KCCWPNC
C11 C13 C15 C17 C23 C25 C27 = CMP-001-00084-1: Cap Aluminum 100uF 50V 20% (8 X 11.5mm) Radial 5mm 870mA 6000 hr 105C Ammo Pack; MP: EEU-FR1H101B; MF: Panasonic Electronic; Pins: 2; Design Item ID: EEUFR1H101B; Purchase-URL: https://pricing.snapeda.com/search/part/EEU-FR1H101B/?ref=eda; Case/Package: RADIAL-2 Panasonic; Check_prices: https://www.snapeda.com/parts/EEU-FR1H101B/Panasonic%20Electronic%20Components/view-part/1356823/?ref=eda; SnapEDA_Link: https://www.snapeda.com/parts/EEU-FR1H101B/Panasonic%20Electronic%20Components/view-part/1356823/?ref=snap; Source: EEUFR1H101B.SchLib; Availability: In Stock; Price: None; Component Type: Standard
J5-J7 = 1751264: as J3 on sheet Entry_Protection; Copyright: Copyright (C) 2025 Ultra Librarian. All rights reserved.; Manufacturer_Part_Number: 1751264; RefDes: RefDes; Type: Type
J8-J11 = S04B-PASK-2: Description; Manufacturer_Name: JST; Type: Headers, Male Pins; Copyright: Copyright (C) 2025 Ultra Librarian. All rights reserved.; Manufacturer_Part_Number: S04B-PASK-2; RefDes: RefDes
TPUART_J1J4 TPUART_J5CLAW = CMP-007-000000-1: as TP24V_Motor on sheet Entry_Protection; MP: 5260; Source: 5260.SchLib; Check_prices: https://www.snapeda.com/parts/5260/Keystone/view-part/?ref=eda; SnapEDA_Link: https://www.snapeda.com/parts/5260/Keystone/view-part/?ref=snap; Package: None; Pin Count: 1; Value: *; Design Item ID: 5260; Component Type: Standard
U4-U10 = CMP-005-000000-1: TMC2209 Motor Controller/Driver Power Management Evaluation Board; MP: TMC2209 SILENTSTEPSTICK; MF: Trinamic Motion Control GmbH; Pin Count: 18; SnapEDA_Link: https://www.snapeda.com/parts/TMC2209%20SILENTSTEPSTICK/Trinamic/view-part/?ref=snap; Source: TMC2209_SILENTSTEPSTICK.SchLib; Design Item ID: TMC2209_SILENTSTEPSTICK; Component Type: Standard; Package: None; Check_prices: https://www.snapeda.com/parts/TMC2209%20SILENTSTEPSTICK/Trinamic/view-part/?ref=eda; Value: *

## Sheet Spare_Pins.SchDoc
size Letter; SheetNumber: 5; SheetTotal: 5
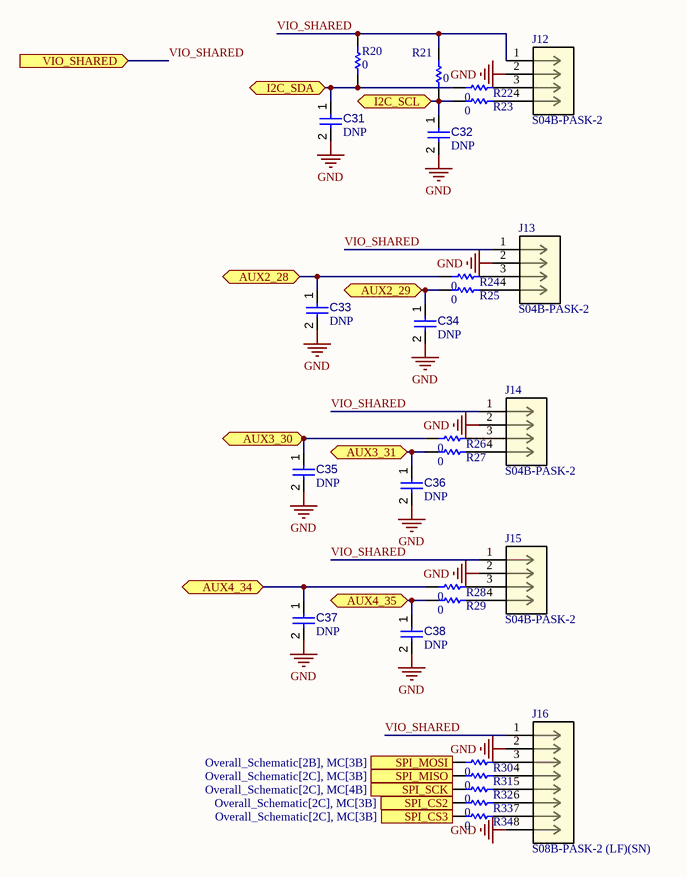
[diagram p4: Spare_Pins.SchDoc]

### Parts
C31  value DNP  [CAPC1608X90X40ML10T20]  (hidden comment: DNP/placeholder)
C32  value DNP  [CAPC1608X90X40ML10T20]  (hidden comment: DNP/placeholder)
C33  value DNP  [CAPC1608X90X40ML10T20]  (hidden comment: DNP/placeholder)
C34  value DNP  [CAPC1608X90X40ML10T20]  (hidden comment: DNP/placeholder)
C35  value DNP  [CAPC1608X90X40ML10T20]  (hidden comment: DNP/placeholder)
C36  value DNP  [CAPC1608X90X40ML10T20]  (hidden comment: DNP/placeholder)
C37  value DNP  [CAPC1608X90X40ML10T20]  (hidden comment: DNP/placeholder)
C38  value DNP  [CAPC1608X90X40ML10T20]  (hidden comment: DNP/placeholder)
J12  S04B-PASK-2  [CONN4_S04B-PASK_JST]
J13  S04B-PASK-2  [CONN4_S04B-PASK_JST]
J14  S04B-PASK-2  [CONN4_S04B-PASK_JST]
J15  S04B-PASK-2  [CONN4_S04B-PASK_JST]
J16  S08B-PASK-2 (LF)(SN)  [CONN_S08B-PASK-2_JST]
R20  value 0  [RESC1608X55X25ML10T15]  (hidden comment: Resistor 0R +/- 5% 0603 100 mW)
R21  value 0  [RESC1608X55X25ML10T15]  (hidden comment: Resistor 0R +/- 5% 0603 100 mW)
R22  value 0  [RESC1608X55X25ML10T15]  (hidden comment: Resistor 0R +/- 5% 0603 100 mW)
R23  value 0  [RESC1608X55X25ML10T15]  (hidden comment: Resistor 0R +/- 5% 0603 100 mW)
R24  value 0  [RESC1608X55X25ML10T15]  (hidden comment: Resistor 0R +/- 5% 0603 100 mW)
R25  value 0  [RESC1608X55X25ML10T15]  (hidden comment: Resistor 0R +/- 5% 0603 100 mW)
R26  value 0  [RESC1608X55X25ML10T15]  (hidden comment: Resistor 0R +/- 5% 0603 100 mW)
R27  value 0  [RESC1608X55X25ML10T15]  (hidden comment: Resistor 0R +/- 5% 0603 100 mW)
R28  value 0  [RESC1608X55X25ML10T15]  (hidden comment: Resistor 0R +/- 5% 0603 100 mW)
R29  value 0  [RESC1608X55X25ML10T15]  (hidden comment: Resistor 0R +/- 5% 0603 100 mW)
R30  value 0  [RESC1608X55X25ML10T15]  (hidden comment: Resistor 0R +/- 5% 0603 100 mW)
R31  value 0  [RESC1608X55X25ML10T15]  (hidden comment: Resistor 0R +/- 5% 0603 100 mW)
R32  value 0  [RESC1608X55X25ML10T15]  (hidden comment: Resistor 0R +/- 5% 0603 100 mW)
R33  value 0  [RESC1608X55X25ML10T15]  (hidden comment: Resistor 0R +/- 5% 0603 100 mW)
R34  value 0  [RESC1608X55X25ML10T15]  (hidden comment: Resistor 0R +/- 5% 0603 100 mW)

### Ports
AUX2_28 (bidir, see Overall_Schematic[2B], MC[4B]), AUX2_29 (bidir, see Overall_Schematic[2B], MC[4B]), AUX3_30 (bidir, see Overall_Schematic[2B], MC[4B]), AUX3_31 (bidir, see Overall_Schematic[2B], MC[4B]), AUX4_34 (bidir, see Overall_Schematic[2B], MC[4B]), AUX4_35 (bidir, see Overall_Schematic[2B], MC[4B]), I2C_SCL (bidir, see Overall_Schematic[2B], MC[4B]), I2C_SDA (bidir, see Overall_Schematic[2B], MC[4B]), SPI_CS2 (in, see Overall_Schematic[2C], MC[3B]), SPI_CS3 (in, see Overall_Schematic[2C], MC[3B]), SPI_MISO (out, see Overall_Schematic[2C], MC[3B]), SPI_MOSI (in, see Overall_Schematic[2B], MC[3B]), SPI_SCK (in, see Overall_Schematic[2C], MC[4B]), VIO_SHARED (in, see Overall_Schematic[2C], MC[3C], Ｄｒｉｖｅｒｓ[1A])

### Nets
GND: C31.2 C32.2 C33.2 C34.2 C35.2 C36.2 C37.2 C38.2 J12.2 J13.2 J14.2 J15.2 J16.2 J16.8
VIO_SHARED: J12.1 J13.1 J14.1 J15.1 J16.1 R20.2 R21.2 ; port VIO_SHARED
NetC31_1: C31.1 R20.1 R22.1 ; port I2C_SDA
NetC32_1: C32.1 R21.1 R23.1 ; port I2C_SCL
NetC33_1: C33.1 R24.1 ; port AUX2_28
NetC34_1: C34.1 R25.1 ; port AUX2_29
NetC35_1: C35.1 R26.1 ; port AUX3_30
NetC36_1: C36.1 R27.1 ; port AUX3_31
NetC37_1: C37.1 R28.1 ; port AUX4_34
NetC38_1: C38.1 R29.1 ; port AUX4_35
NetJ12_3: J12.3 R22.2
NetJ12_4: J12.4 R23.2
NetJ13_3: J13.3 R24.2
NetJ13_4: J13.4 R25.2
NetJ14_3: J14.3 R26.2
NetJ14_4: J14.4 R27.2
NetJ15_3: J15.3 R28.2
NetJ15_4: J15.4 R29.2
NetJ16_3: J16.3 R30.2
NetJ16_4: J16.4 R31.2
NetJ16_5: J16.5 R32.2
NetJ16_6: J16.6 R33.2
NetJ16_7: J16.7 R34.2
NetR30_1: R30.1 ; port SPI_MOSI
NetR31_1: R31.1 ; port SPI_MISO
NetR32_1: R32.1 ; port SPI_SCK
NetR33_1: R33.1 ; port SPI_CS2
NetR34_1: R34.1 ; port SPI_CS3

### Library data of the parts
C31-C38 = CMP-001-00014-6: 0603 (1608 Metric); Capacitor Type: Ceramic; Tolerance: 5%; Voltage Rating: 50V; RoHS Compliant: True; Case/Package: 0603; Max Operating Temperature: 125°C; Pins: 2; Mounting Technology: SM; Min Operating Temperature: -55°C
J12-J15 = S04B-PASK-2: Description; Manufacturer_Name: JST; Type: Headers, Male Pins; Copyright: Copyright (C) 2025 Ultra Librarian. All rights reserved.; Manufacturer_Part_Number: S04B-PASK-2; RefDes: RefDes
J16 = S08B-PASK-2 LFSN: Description; Manufacturer_Name: JST; Copyright: Copyright (C) 2026 Ultra Librarian. All rights reserved.; Manufacturer_Part_Number: S08B-PASK-2 (LF)(SN); RefDes: RefDes; Type: Type
R20-R34 = CMP-009-00006-5: Chip Resistor, 0 Ohm, 0.1 W, -55 to 155 degC, 0603 (1608 Metric); Power: 100mW; Voltage Rating: 50V; Max Operating Temperature: 155°C; RoHS Compliant: True; Mounting Technology: SM; Case/Package: 0603; Min Operating Temperature: -55°C; Tolerance: 5%; Pins: 2

## Nets that join several sheets
GND: Entry_Protection (9 pins), MC (22 pins), Ｄｒｉｖｅｒｓ (43 pins), Spare_Pins (14 pins)
24V_Motor: Entry_Protection (C39.1 J2.2 TP24V_Motor.1), Ｄｒｉｖｅｒｓ (21 pins)
24V_Protected: Entry_Protection (12 pins), MC (7 pins)
EN_SHARED: MC (R19.2 TPEN_SHARED.1 U2.41), Ｄｒｉｖｅｒｓ (7 pins)
NetC31_1: MC (U2.19), Spare_Pins (C31.1 R20.1 R22.1)
NetC32_1: MC (U2.18), Spare_Pins (C32.1 R21.1 R23.1)
NetC33_1: MC (U2.29), Spare_Pins (C33.1 R24.1)
NetC34_1: MC (U2.28), Spare_Pins (C34.1 R25.1)
NetC35_1: MC (U2.30), Spare_Pins (C35.1 R26.1)
NetC36_1: MC (U2.31), Spare_Pins (C36.1 R27.1)
NetC37_1: MC (U2.34), Spare_Pins (C37.1 R28.1)
NetC38_1: MC (U2.35), Spare_Pins (C38.1 R29.1)
NetJ3_4: Entry_Protection (J3.4 TPE-STOP.1), MC (R9.1)
NetR6_1: MC (R6.1), Ｄｒｉｖｅｒｓ (U10.10)
NetR7_2: MC (R7.2), Ｄｒｉｖｅｒｓ (U6.10)
NetR8_2: MC (R8.2), Ｄｒｉｖｅｒｓ (U5.10)
NetR12_1: MC (R12.1), Ｄｒｉｖｅｒｓ (U9.10)
NetR13_1: MC (R13.1), Ｄｒｉｖｅｒｓ (U8.10)
NetR14_2: MC (R14.2 U2.7), Ｄｒｉｖｅｒｓ (TPUART_J5CLAW.1 U8.12 U9.12 U10.12)
NetR15_1: MC (R15.1), Ｄｒｉｖｅｒｓ (U4.10)
NetR16_2: MC (R16.2 U2.0), Ｄｒｉｖｅｒｓ (5 pins)
NetR18_2: MC (R18.2), Ｄｒｉｖｅｒｓ (U7.10)
NetR30_1: MC (U2.11), Spare_Pins (R30.1)
NetR31_1: MC (U2.12), Spare_Pins (R31.1)
NetR32_1: MC (U2.13), Spare_Pins (R32.1)
NetR33_1: MC (U2.36), Spare_Pins (R33.1)
NetR34_1: MC (U2.37), Spare_Pins (R34.1)
NetU2_14: MC (U2.14), Ｄｒｉｖｅｒｓ (U4.9)
NetU2_15: MC (U2.15), Ｄｒｉｖｅｒｓ (U5.9)
NetU2_16: MC (U2.16), Ｄｒｉｖｅｒｓ (U6.9)
NetU2_17: MC (U2.17), Ｄｒｉｖｅｒｓ (U7.9)
NetU2_20: MC (U2.20), Ｄｒｉｖｅｒｓ (U8.9)
NetU2_21: MC (U2.21), Ｄｒｉｖｅｒｓ (U9.9)
NetU2_22: MC (U2.22), Ｄｒｉｖｅｒｓ (U10.9)
NetU2_24: MC (U2.24), Ｄｒｉｖｅｒｓ (U4.18)
NetU2_25: MC (U2.25), Ｄｒｉｖｅｒｓ (U5.18)
NetU2_26: MC (U2.26), Ｄｒｉｖｅｒｓ (U6.18)
NetU2_27: MC (U2.27), Ｄｒｉｖｅｒｓ (U7.18)
NetU2_38: MC (U2.38), Ｄｒｉｖｅｒｓ (U8.18)
NetU2_39: MC (U2.39), Ｄｒｉｖｅｒｓ (U9.18)
NetU2_40: MC (U2.40), Ｄｒｉｖｅｒｓ (U10.18)
VIO_SHARED: MC (R35.1 TPVIO_SHARED.1 U2.3.3V_3), Ｄｒｉｖｅｒｓ (20 pins), Spare_Pins (7 pins)